# EAGLE design blinkm2neo_5Jul2020_qfn (EAGLE 9.6.2)
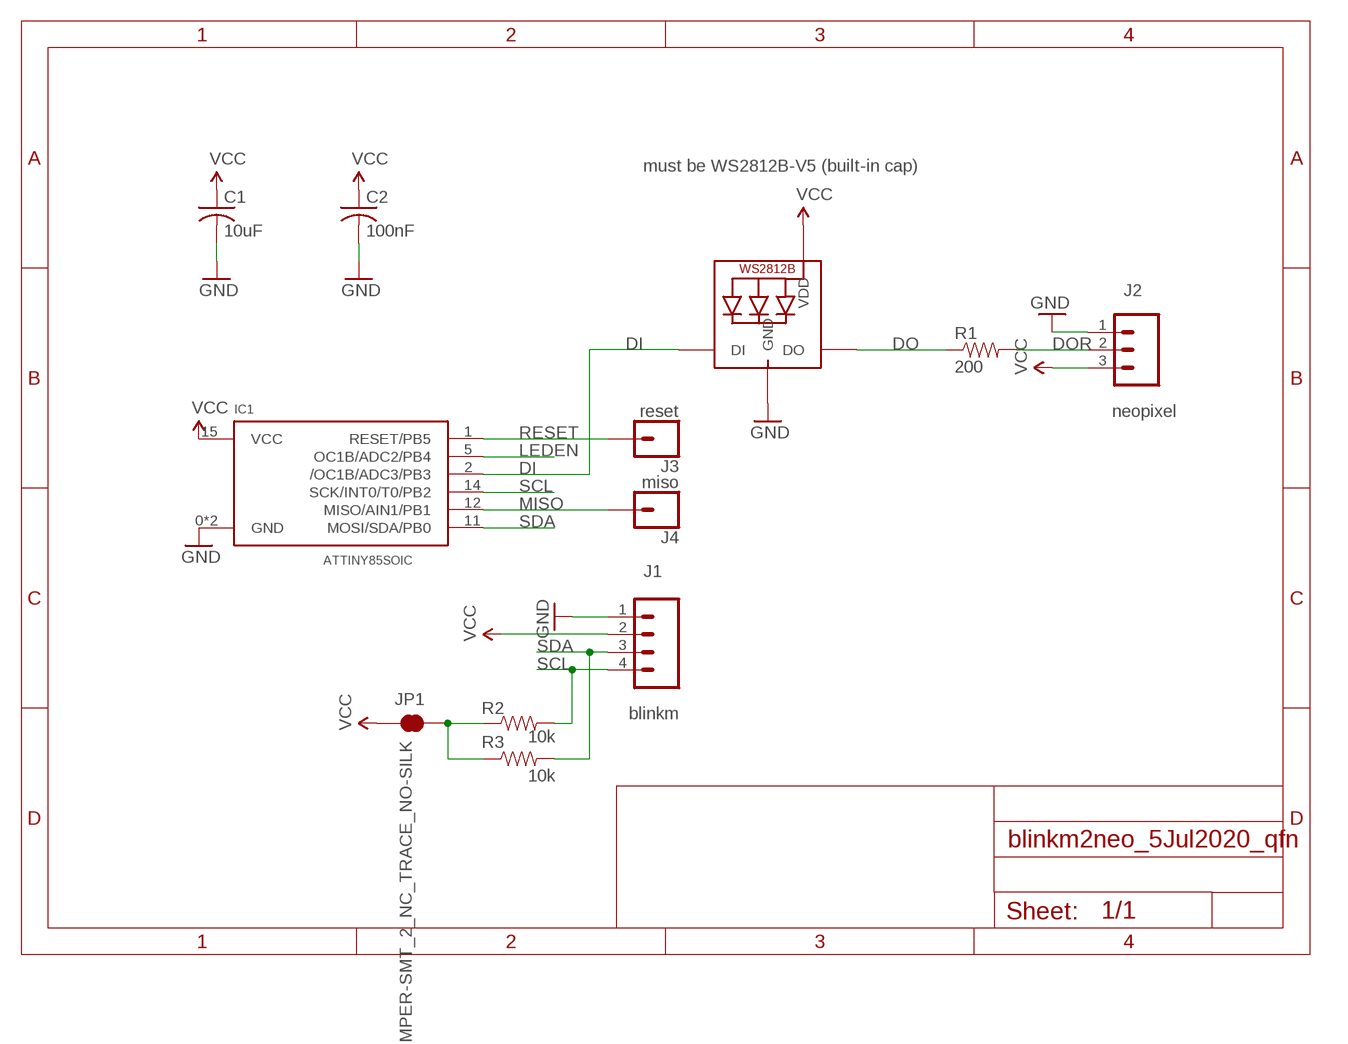
[diagram p0: schematic, sheet 1]

## Parts
C1  10uF  C-USC0402  [C0402]
C2  100nF  C-USC0402  [C0402]
IC1  ATTINY85SOIC  ATTINY45QFN  [QFN20]
J1  blinkm  CONN_04  [1X04]
J2  neopixel  CONN_03  [1X03]
J3  reset  CONN_01PTH_NO_SILK_YES_STOP  [1X01_NO_SILK]
J4  miso  CONN_01PTH_NO_SILK_YES_STOP  [1X01_NO_SILK]
JP1  JUMPER-SMT_2_NC_TRACE_NO-SILK  [SMT-JUMPER_2_NC_TRACE_NO-SILK]
LED1  WS2812B-V5  WS2812B5050  [WS2812B]
R1  200  RESISTOR0402  [0402]
R2  10k  RESISTOR0402  [0402]
R3  10k  RESISTOR0402  [0402]

## Nets
DI: IC1.2(/OC1B/ADC3/PB3) LED1.4-DIN(DI)
DO: LED1.2-DOUT(DO) R1.1
DOR: J2.2 R1.2
GND: C1.2 C2.2 IC1.0(GND) IC1.8(GND) J1.1 J2.1 LED1.3-GND(GND)
LEDEN: IC1.5(OC1B/ADC2/PB4)
MISO: IC1.12(MISO/AIN1/PB1) J4.1
N$1: JP1.2 R2.1 R3.1
RESET: IC1.1(RESET/PB5) J3.1
SCL: IC1.14(SCK/INT0/T0/PB2) J1.4 R2.2
SDA: IC1.11(MOSI/SDA/PB0) J1.3 R3.2
VCC: C1.1 C2.1 IC1.15(VCC) J1.2 J2.3 JP1.1 LED1.1-VDD(VDD)

## Notes on the sheet
- must be WS2812B-V5 (built-in cap)

## Library data of the parts
C1 C2 = rcl:C-US: CAPACITOR, American symbol; SPICEPREFIX: C
IC1 = todstuff:ATTINY45
J1 = SparkFun-Connectors:CONN_04: Multi connection point. Often used as Generic Header-pin footprint for 0.1 inch spaced/style header connections On any of the 0.1 inch spaced packages, you can populate with these: Break Away Headers - Straight <https://www.sparkfun.com/products/116> (PRT-00116) Break Away Male Headers - Right Angle <https://www.sparkfun.com/products/553> (PRT-00553) Female Headers <https://www.sparkfun.com/products/115> (PRT-00115) Break Away Headers - Machine Pin <https://www.sparkfun.com/products/117> (PRT-00117) Break Away Female Headers - Swiss Machine Pin <https://www.sparkfun.com/products/743> (PRT-00743) For SCREWTERMINALS and SPRING TERMINALS visit here: Screw Terimnals on SparkFun.com <https://www.sparkfun.com/search/results?term=Screw+Terminals> (5mm/3.5mm/2.54mm spacing) This device is also useful as a general connection point to wire up your design to another part of your project. Our various solder wires solder well into these plated through hole pads. Hook-Up Wire - Assortment (Stranded, 22 AWG) <https://www.sparkfun.com/products/11375> (PRT-11375) Hook-Up Wire - Assortment (Solid Core, 22 AWG) <https://www.sparkfun.com/products/11367> (PRT-11367) View the entire wire category on our website here <https://www.sparkfun.com/categories/141> Special notes: Molex polarized connector foot print use with SKU : PRT-08231 with associated crimp pins and housings. 1MM SMD Version SKU: PRT-10208; PROD_ID: CONN-09696
J2 = SparkFun-Connectors:CONN_03: Multi connection point. Often used as Generic Header-pin footprint for 0.1 inch spaced/style header connections On any of the 0.1 inch spaced packages, you can populate with these: Break Away Headers - Straight <https://www.sparkfun.com/products/116> (PRT-00116) Break Away Male Headers - Right Angle <https://www.sparkfun.com/products/553> (PRT-00553) Female Headers <https://www.sparkfun.com/products/115> (PRT-00115) Break Away Headers - Machine Pin <https://www.sparkfun.com/products/117> (PRT-00117) Break Away Female Headers - Swiss Machine Pin <https://www.sparkfun.com/products/743> (PRT-00743) Stackable Header - 3 Pin (Female, 0.1") <https://www.sparkfun.com/products/13875> (PRT-13875) For SCREWTERMINALS and SPRING TERMINALS visit here: Screw Terimnals on SparkFun.com <https://www.sparkfun.com/search/results?term=Screw+Terminals> (5mm/3.5mm/2.54mm spacing) This device is also useful as a general connection point to wire up your design to another part of your project. Our various solder wires solder well into these plated through hole pads. Hook-Up Wire - Assortment (Stranded, 22 AWG) <https://www.sparkfun.com/products/11375> (PRT-11375) Hook-Up Wire - Assortment (Solid Core, 22 AWG) <https://www.sparkfun.com/products/11367> (PRT-11367) View the entire wire category on our website here <https://www.sparkfun.com/categories/141> Special notes: Molex polarized connector foot print use with SKU : PRT-08232 with associated crimp pins and housings.
J3 J4 = SparkFun-Connectors:CONN_01: Single connection point. Often used as Generic Header-pin footprint for 0.1 inch spaced/style header connections On any of the 0.1 inch spaced packages, you can populate with these: Break Away Headers - Straight <https://www.sparkfun.com/products/116> (PRT-00116) Break Away Male Headers - Right Angle <https://www.sparkfun.com/products/553> (PRT-00553) Female Headers <https://www.sparkfun.com/products/115> (PRT-00115) Break Away Headers - Machine Pin <https://www.sparkfun.com/products/117> (PRT-00117) Break Away Female Headers - Swiss Machine Pin <https://www.sparkfun.com/products/743> (PRT-00743) This device is also useful as a general connection point to wire up your design to another part of your project. Our various solder wires solder well into these plated through hole pads. Hook-Up Wire - Assortment (Stranded, 22 AWG) <https://www.sparkfun.com/products/11375> (PRT-11375) Hook-Up Wire - Assortment (Solid Core, 22 AWG) <https://www.sparkfun.com/products/11367> (PRT-11367) View the entire wire category on our website here <https://www.sparkfun.com/categories/141> Special notes: SMTSO-256-ET is a "flush mount" nut for a 4-40 screw. We mostly use this on specialty testbeds; it is a nice way to connect hardware to your PCB at an adjustable hieght. Also note, the SNAP packages are for using a snappable style connector. We sell a baggie of snaps and they are also used on two LilyPad designs: Snap Assortment - 30 pack (male and female) <https://www.sparkfun.com/products/11347> (DEV-11347) LilyPad Arduino SimpleSnap <https://www.sparkfun.com/products/10941> (DEV-10941) LilyPad SimpleSnap Protoboard <https://www.sparkfun.com/products/10940> (DEV-10940)
JP1 = SparkFun-Jumpers:JUMPER-SMT_2_NC_TRACE: Normally closed trace jumper This jumper has a trace between two pads so it's normally closed (NC). Use a razor knife to open the connection. For best results follow the IPC guidelines for cutting traces: Cutout at least 0.063 mm (0.005 in). Remove all loose material to clean up the cut area. Seal the cut with an approved epoxy. Reapply solder to reclose the connection.
LED1 = adafruit:WS2812B
R1-R3 = SparkFun-Resistors:RESISTOR: Generic Resistor Package

## Board
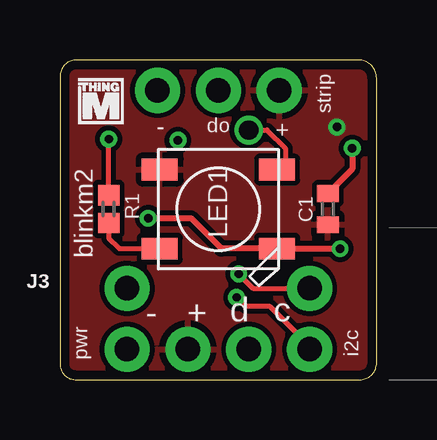
[diagram p1: board, top side]
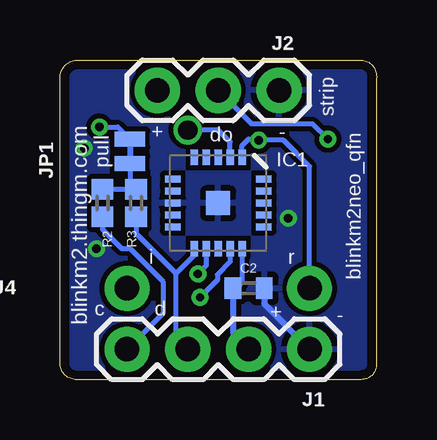
[diagram p2: board, bottom side, seen from below]

Size 13.21 x 13.34 mm. Coordinates in mm from the lower left corner, seen from the top.
Outline: 12.45,13.34 0.64,13.34 arc90 0,12.58 0,0.64 arc90 0.64,0 12.45,0 arc90 13.21,0.64 13.21,12.58 arc90 12.45,13.34
Copper layers (1*16): Top 0.0356mm / dielectric 0.93mm / Bottom 0.0356mm
Design rules "LaenPCBOrderTodTent8mil *": minimum track width 8mil, minimum drill 13mil, track to track 8mil, track to pad 8mil, pad to pad 8mil, via to via 8mil, smd to smd 8mil, copper to edge 15mil, drill to drill 8mil, minimum pad ring 7mil, minimum via ring 7mil, stop-mask expansion 3mil, vias tented up to drill 20mil, thermal gap 10mil
vRestrict: area 4.2,5.3 to 6.1,7

### Footprints (pad centres in the part's own frame; a part is rotated, then mirrored left to right if it is on the bottom)
C0402 = smd 0.7 x 0.9: 1 -0.65,0; 2 0.65,0
QFN20 = smd 1 x 1: 0 0,0 | smd 0.65 x 0.3: 1 -1.9,1; 2 -1.9,0.5; 3 -1.9,0; 4 -1.9,-0.5; 5 -1.9,-1; 11 1.9,-1; 12 1.9,-0.5; 13 1.9,0; 14 1.9,0.5; 15 1.9,1 | smd 0.3 x 0.65: 6 -1,-1.9; 7 -0.5,-1.9; 8 0,-1.9; 9 0.5,-1.9; 10 1,-1.9; 16 1,1.9; 17 0.5,1.9; 18 0,1.9; 19 -0.5,1.9; 20 -1,1.9
1X04 = drill 1.016 pad 1.88: 1 0,0; 2 2.54,0; 3 5.08,0; 4 7.62,0
1X03 = drill 1.016 pad 1.88: 1 0,0; 2 2.54,0; 3 5.08,0
1X01_NO_SILK = drill 1.016 pad 1.88: 1 0,0
SMT-JUMPER_2_NC_TRACE_NO-SILK = smd 0.635 x 1.27: 1 -0.508,0; 2 0.508,0
WS2812B = smd 1.5 x 0.9: 1-VDD 2.45,-1.65; 2-DOUT 2.45,1.65; 3-GND -2.45,1.65; 4-DIN -2.45,-1.65
0402 = smd 0.85 x 0.9: 1 -0.58,0; 2 0.58,0

### Placement (x,y rotation side)
C1  11.18,7.11 90 top
C2  5.34,3.81 0 bottom
IC1  6.61,7.37 270 bottom
J1  2.8,1.27 180 bottom
J2  4.07,12.07 180 bottom
J3  2.8,3.81 0 top
J4  10.42,3.81 0 bottom
JP1  10.29,9.53 270 bottom
LED1  6.61,7.11 180 top
R1  2.03,7.11 90 top
R2  11.43,7.37 270 bottom
R3  10.04,7.37 270 bottom
U$1  [THINGM_LOGO_0.075IN]  0.76,10.67 0 top

### Tracks (layer width: path | path; a pad name or v marks a point on that pad's centre or on a via)
DI  (via drill 0.8)
  Top 0.203: 9.4,9.11 9.4,9.65 8.64,10.42 v7.88,10.42
  Top 0.254: 9.4,9.11 LED1.4-DIN
  Bottom 0.203: IC1.2 6.11,9.92 6.61,10.42 v7.88,10.42
DO
  Top 0.203: LED1.2-DOUT 2.47,5.46 2.03,5.9 R1.1
DOR  (via drill 0.35)
  Top 0.203: R1.2 v2.03,10.04
  Bottom 0.203: v2.03,10.04 2.67,10.67 5.21,10.67 J2.2
GND  (via drill 0.35)
  Top 0.254: v11.69,5.46 LED1.3-GND 6.73,5.46 5.46,6.73 v3.69,6.73 | v12.19,9.65 12.19,8.78 C1.2
  Bottom 0.254: C2.2 4.69,3.16 J1.1
  pour Bottom: 14.1,14.1 14.1,-1.27 -1.01,-1.27 -1.01,14.1
MISO  (via drill 0.35)
  Top 0.203: v7.46,4.41 8.05,3.81 J4.1
  Bottom 0.203: IC1.12 7.11,4.76 v7.46,4.41
N$1
  Bottom 0.203: 10.06,7.98 R3.1 | R2.1 10.09,7.95 | 10.09,7.95 10.06,7.98 | 10.29,8.15 10.09,7.95 | JP1.2 10.29,8.2 10.06,7.98
RESET  (via drill 0.35)
  Bottom 0.203: IC1.1 5.61,9.77 5.34,10.04 4.97,10.04 | v4.92,9.99 3.89,9.99 2.8,8.89 J3.1
  Bottom 0.254: v4.92,9.99 4.97,10.04
SCL  (via drill 0.35)
  Top 0.203: J1.4 10.42,1.4 8.77,3.05 7.75,3.05 v7.37,3.43
  Bottom 0.203: v7.37,3.43 6.64,4.16 6.64,4.39 6.11,4.92 IC1.14 | J1.4 8.92,2.77 8.92,4.09 10.29,5.46 10.63,5.46 11.43,6.27 R2.2
SDA
  Bottom 0.203: J1.3 8.38,1.78 8.38,4.41 | 8.38,4.41 7.61,5.19 IC1.11 | R3.2 10.04,6.1 8.38,4.45 8.38,4.41
VCC  (via drill 0.35)
  Bottom 0.203: IC1.15 5.61,4.05 5.84,3.81 C2.1 | JP1.1 10.8,10.54 v11.56,10.54
  Bottom 0.254: J1.2 5.34,1.3 5.99,1.95 C2.1
  pour Top: -0.63,13.97 13.59,13.97 13.59,-0.38 -0.63,-0.38

### Text on the board
tPlace: strip | - | do | + | blinkm2 | pwr | - | + | d | c | i2c
bPlace: strip | - | do | + | pull | blinkm2neo_qfn | r | i | + | d | c | - | blinkm2.thingm.com